# Altium schematic sheet Display.SchDoc: EPD driver and connector
size A4; Date: Not used; ApprovedBy: Not used; CheckedBy: Not used; Author: Not used; CompanyName: STMicroelectronics; DrawnBy: Not used; Engineer: Not used; Organization: Not used; Address1: Not used; Address2: Not used; Address3: Not used; Address4: Not used; DocumentNumber: Not used; Revision: 1.0.0; SheetNumber: 3; SheetTotal: 6; CurrentTime: Not used; CurrentDate: Not used; Time: Not used; DocumentFullPathAndName: Not used; DocumentName: Not used; ModifiedDate: Not used; ImagePath: Not used; ProjectName: Not used; Application_BuildNumber: Not used
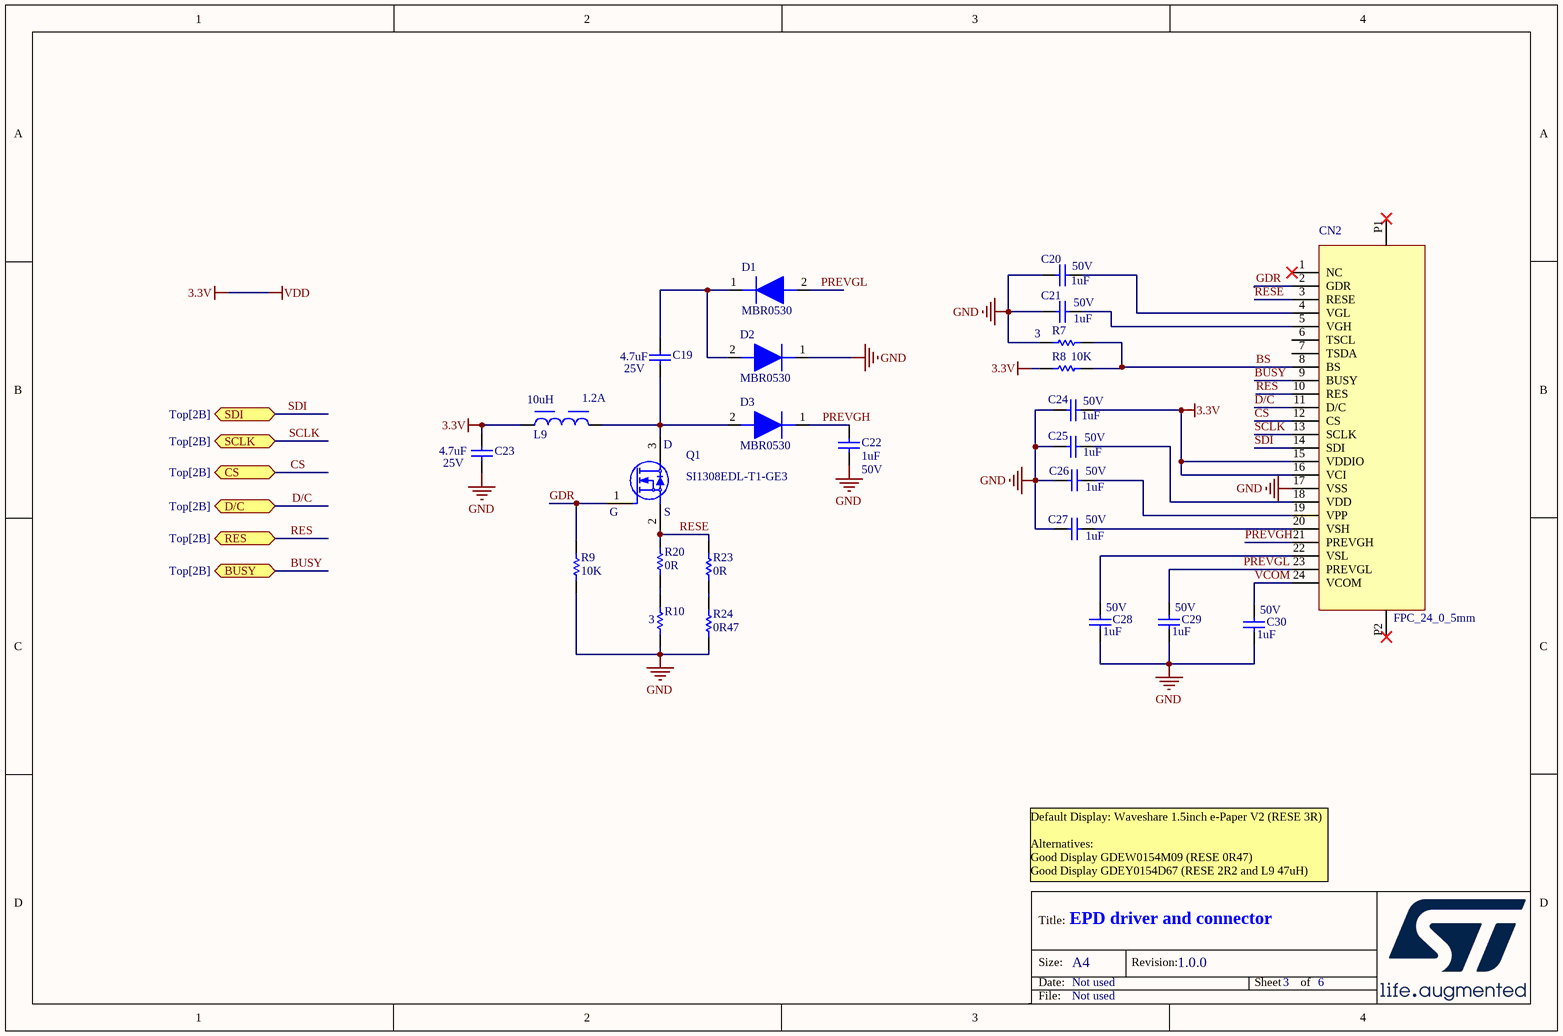
[diagram p0: Display.SchDoc]

## Parts
C19  value 4.7uF  Voltage: 25V  [C0603]  (hidden comment: Capacitor)
C20  value 1uF  Voltage Rating: 50V  [C0603_H0P8]  (hidden comment: Capacitor)
C21  value 1uF  Voltage Rating: 50V  [C0603_H0P8]  (hidden comment: Capacitor)
C22  value 1uF  Voltage Rating: 50V  [C0603_H0P8]  (hidden comment: Capacitor)
C23  value 4.7uF  Voltage: 25V  [C0603]  (hidden comment: Capacitor)
C24  value 1uF  Voltage Rating: 50V  [C0603_H0P8]  (hidden comment: Capacitor)
C25  value 1uF  Voltage Rating: 50V  [C0603_H0P8]  (hidden comment: Capacitor)
C26  value 1uF  Voltage Rating: 50V  [C0603_H0P8]  (hidden comment: Capacitor)
C27  value 1uF  Voltage Rating: 50V  [C0603_H0P8]  (hidden comment: Capacitor)
C28  value 1uF  Voltage Rating: 50V  [C0603_H0P8]  (hidden comment: Capacitor)
C29  value 1uF  Voltage Rating: 50V  [C0603_H0P8]  (hidden comment: Capacitor)
C30  value 1uF  Voltage Rating: 50V  [C0603_H0P8]  (hidden comment: Capacitor)
CN2  FPC_24_0_5mm  [CON_5034802400_MOL]
D1  MBR0530  [SOD3716X135N]
D2  MBR0530  [SOD3716X135N]
D3  MBR0530  [SOD3716X135N]
L9  Inductance: 10uH  Rated Current: 1.2A  [WE-LQS_4018]  (hidden comment: 10uH, 1.2A)
Q1  value SI1308EDL-T1-GE3  [MOS_SOT323-3L]  (hidden comment: MOSFET_N-CHANNEL)
R7  value 3  [R0402]  (hidden comment: Resistor)
R8  value 10K  [R0402]  (hidden comment: Resistor)
R9  value 10K  [R0402]  (hidden comment: Resistor)
R10  value 3  [R0402]  (hidden comment: Resistor)
R20  value 0R  [R0402]  (hidden comment: Resistor)
R23  value 0R  [R0402]  (hidden comment: Resistor)
R24  value 0R47  [R0402]  (hidden comment: Resistor)

## Ports
BUSY (bidir, see Top[2B]), CS (bidir, see Top[2B]), D/C (bidir, see Top[2B]), RES (bidir, see Top[2B]), SCLK (bidir, see Top[2B]), SDI (bidir, see Top[2B])

## Nets
3.3V: C23.2 C24.2 CN2.15(VDDIO) CN2.16(VCI) L9.1 R8.1  [also labelled VDD]
GND: C20.1 C21.1 C22.1 C23.1 C24.1 C25.1 C26.1 C27.1 C28.1 C29.1 C30.1 CN2.17(VSS) D2.1 R7.2 R9.1 R10.1 R24.2
BS: CN2.8(BS) R7.1 R8.2
BUSY: CN2.9(BUSY) ; port BUSY
CS: CN2.12(CS) ; port CS
D/C: CN2.11(D/C) ; port D/C
GDR: CN2.2(GDR) Q1.1(G) R9.2
PREVGH: C22.2 CN2.21(PREVGH) D3.1
PREVGL: C29.2 CN2.23(PREVGL) D1.2
RES: CN2.10(RES) ; port RES
RESE: CN2.3(RESE) Q1.2(S) R20.2 R23.2
SCLK: CN2.13(SCLK) ; port SCLK
SDI: CN2.14(SDI) ; port SDI
VCOM: C30.2 CN2.24(VCOM)
NetC19_1: C19.1 D3.2 L9.2 Q1.3(D)
NetC19_2: C19.2 D1.1 D2.2
NetC20_2: C20.2 CN2.4(VGL)
NetC21_2: C21.2 CN2.5(VGH)
NetC25_2: C25.2 CN2.18(VDD)
NetC26_2: C26.2 CN2.19(VPP)
NetC27_2: C27.2 CN2.20(VSH)
NetC28_2: C28.2 CN2.22(VSL)
NetR10_2: R10.2 R20.1
NetR23_1: R23.1 R24.1

Not connected (* = marked no-connect by the designer): CN2 1(NC)* 6(TSCL) 7(TSDA) P1(NC)* P2(NC)*

## Notes on the sheet
- Default Display: Waveshare 1.5inch e-Paper V2 (RESE 3R)
  Alternatives:
  Good Display GDEW0154M09 (RESE 0R47)
  Good Display GDEY0154D67 (RESE 2R2 and L9 47uH)
- Title:
- Size:
- Date:
- A4
- Revision:
- Sheet
- of
- File:

## Library data of the parts
C19 C23 = MCD-02196: CAP CER 4.7UF 25V X6S 0603; Manufacturer: Murata; Manufacturer Part Number: GRM188C81E475KE11D; ComponentLink1URL: http://tunmcdsvn.tun.st.com/Component_Documentation_Library/Trunk/Capacitor/TDK_C_Series; Supplier 1: Digi-Key; Supplier Part Number 1: 490-7199-1-ND; RoHS: Yes; Category: Ceramic Capacitors; Stock 1: 947554; Pricing 1: 1=0.27, 10=0.175, 50=0.1104, 100=0.0884, 500=0.06382, 1000=0.05645 (USD); ComponentLink2URL: https://datasheet.ciiva.com/14906/partnumbering-e-01-14906423.pdf?src-supplier=Digi-Key; ComponentLink2Description: https://datasheet.ciiva.com/14906/partnumbering-e-01-14906423.pdf?src-supplier=Digi-Key; ComponentLink3URL: https://datasheet.ciiva.com/14906/partnumbering-e-01-14906424.pdf?src-supplier=Digi-Key; ComponentLink3Description: https://datasheet.ciiva.com/14906/partnumbering-e-01-14906424.pdf?src-supplier=Digi-Key; ComponentLink4URL: https://datasheet.ciiva.com/14906/partnumbering-e-01-14906425.pdf?src-supplier=Digi-Key; ComponentLink4Description: https://datasheet.ciiva.com/14906/partnumbering-e-01-14906425.pdf?src-supplier=Digi-Key
C20-C22 C24-C30 = MCD-01703: Multilayer Ceramic Capacitor, 1 uF, 50 V, ± 10%, X5R, 0603 [1608 Metric]; Manufacturer: Murata; Manufacturer Part Number: GRT188R61H105KE13D; ComponentLink1URL: http://tunmcdsvn.tun.st.com/Component_Documentation_Library/Trunk/Capacitor/YAGEO_X5R_Series; Supplier 1: Digi-Key; Supplier Part Number 1: 490-12330-1-ND; RoHS: Yes; Category: Ceramic Capacitors; Stock 1: 422240; Pricing 1: 1=0.17, 10=0.117, 50=0.07, 100=0.0551, 500=0.04066, 1000=0.03366 (USD); Mounting Technology: Surface Mount; Case/Package: 0603; Case Code (Metric): 1608; Case Code (Imperial): 0603; Min Operating Temperature: -55°C; Max Operating Temperature: 85°C; Packaging: Cut Tape; Tolerance: 10%; Dielectric: X5R; Voltage Rating (DC): 50V; Series: GRT; Length: 0.063inch; Width: 0.031inch; Thickness: 0.035inch; Ratings: AEC-Q200; RoHS Compliant: Yes; ComponentLink2URL: http://www.farnell.com/datasheets/2165959.pdf?src-supplier=Farnell; ComponentLink2Description: http://www.farnell.com/datasheets/2165959.pdf?src-supplier=Farnell; ComponentLink3URL: http://search.murata.co.jp/Ceramy/image/img/A01X/G101/ENG/GRT188R61H105KE13-01.pdf?src-supplier=Digi-Key; ComponentLink3Description: http://search.murata.co.jp/Ceramy/image/img/A01X/G101/ENG/GRT188R61H105KE13-01.pdf?src-supplier=Digi-Key; ComponentLink4URL: http://www.farnell.com/datasheets/2165959.pdf?src-supplier=Newark; ComponentLink4Description: http://www.farnell.com/datasheets/2165959.pdf?src-supplier=Newark; ComponentLink5URL: https://datasheet.octopart.com/GRT188R61H105KE13D-Murata-datasheet-67697751.pdf?src-supplier=Newark; ComponentLink5Description: https://datasheet.octopart.com/GRT188R61H105KE13D-Murata-datasheet-67697751.pdf?src-supplier=Newark; ComponentLink6URL: https://search.murata.co.jp/Ceramy/image/img/A01X/G101/ENG/GRT188R61H105KE13-01.pdf?src-supplier=Digi-Key; ComponentLink6Description: https://search.murata.co.jp/Ceramy/image/img/A01X/G101/ENG/GRT188R61H105KE13-01.pdf?src-supplier=Digi-Key; ComponentLink7URL: https://datasheet.octopart.com/GRT188R61H105KE13D-Murata-datasheet-165579666.pdf?src-supplier=TME; ComponentLink7Description: https://datasheet.octopart.com/GRT188R61H105KE13D-Murata-datasheet-165579666.pdf?src-supplier=TME
CN2 = FPC_24_0_5mm: Conn, Ffc/fpc, R/a, 24Pos, 1Row, 0.5Mm Rohs Compliant: Yes; Manufacturer: Molex; Manufacturer Part Number: 503480-2400; Supplier 1: Digi-Key; Supplier Part Number 1: WM27000CT-ND; RoHS: No; Category: FFC / FPC; Stock 1: 23010; Pricing 1: 1=2.12, 10=1.806, 100=1.492, 1000=1.17791 (USD)
D1-D3 = MBR0530: Diode, Schottky Barrier, Vr 30V, If 0.5A, Pkg SOD-123, Vf 0.43V, Tj +125degc, Cs 5.5A; Manufacturer: ON Semiconductor / Fairchild; Manufacturer Part Number: MBR0530T1G; Supplier 1: Arrow Electronics; Supplier Part Number 1: MBR0530T1G; RoHS: Yes; Category: Schottky Diodes; Stock 1: 24000; Pricing 1: 3000=0.0566, 9000=0.0503, 24000=0.0471, 45000=0.0409 (USD); ComponentLink1URL: https://datasheet.ciiva.com/5763/85890-5763210.pdf?src-supplier=Farnell; ComponentLink1Description: https://datasheet.ciiva.com/5763/85890-5763210.pdf?src-supplier=Farnell; ComponentLink2URL: https://datasheet.ciiva.com/14168/sz600926-e-14168053.pdf?src-supplier=Distrelec; ComponentLink2Description: https://datasheet.ciiva.com/14168/sz600926-e-14168053.pdf?src-supplier=Distrelec; ComponentLink3URL: https://datasheet.ciiva.com/22659/1708258-22659024.pdf?src-supplier=Element14; ComponentLink3Description: https://datasheet.ciiva.com/22659/1708258-22659024.pdf?src-supplier=Element14; ComponentLink4URL: https://datasheet.ciiva.com/8299/mbr0530t1-d-8299686.pdf?src-supplier=Avnet; ComponentLink4Description: https://datasheet.ciiva.com/8299/mbr0530t1-d-8299686.pdf?src-supplier=Avnet; ComponentLink5URL: https://datasheet.ciiva.com/8300/mbr0530t1-d-8300038.pdf?src-supplier=Avnet; ComponentLink5Description: https://datasheet.ciiva.com/8300/mbr0530t1-d-8300038.pdf?src-supplier=Avnet; ComponentLink6URL: https://datasheet.ciiva.com/915/mbr0530t1-d-915467.pdf?src-supplier=Digi-Key; ComponentLink6Description: https://datasheet.ciiva.com/915/mbr0530t1-d-915467.pdf?src-supplier=Digi-Key; ComponentLink7URL: https://datasheet.ciiva.com/915/mbr0530t1-d-915468.pdf?src-supplier=Digi-Key; ComponentLink7Description: https://datasheet.ciiva.com/915/mbr0530t1-d-915468.pdf?src-supplier=Digi-Key; ComponentLink8URL: https://datasheet.ciiva.com/915/mbr0530t1-d-915469.pdf?src-supplier=Digi-Key; ComponentLink8Description: https://datasheet.ciiva.com/915/mbr0530t1-d-915469.pdf?src-supplier=Digi-Key; ComponentLink9URL: https://datasheet.ciiva.com/14560/70099496-14560951.pdf?src-supplier=Allied+Electronics; ComponentLink9Description: https://datasheet.ciiva.com/14560/70099496-14560951.pdf?src-supplier=Allied+Electronics; ComponentLink10URL: https://datasheet.ciiva.com/7962/85890-7962700.pdf?src-supplier=Element14; ComponentLink10Description: https://datasheet.ciiva.com/7962/85890-7962700.pdf?src-supplier=Element14; ComponentLink11URL: https://datasheet.ciiva.com/7962/85890-7962701.pdf?src-supplier=Element14; ComponentLink11Description: https://datasheet.ciiva.com/7962/85890-7962701.pdf?src-supplier=Element14; ComponentLink12URL: https://datasheet.ciiva.com/7962/85890-7962702.pdf?src-supplier=Element14; ComponentLink12Description: https://datasheet.ciiva.com/7962/85890-7962702.pdf?src-supplier=Element14
L9 = 74404042100: WE-LQS SMT Power Inductor, size 4018, 10uH, 1.2A, 0.15Ohm; Manufacturer: Wurth Elektronik; Case/Size Code: 4018; Saturation Current: 1.7A; Self Resonant Frequency: 28MHz; Manufacturer Part Number: 74404042100; Category: Power Inductors; Match Code: WE-LQS; ComponentLink1Description: Website Link; ComponentLink1URL: https://www.we-online.com/redexpert/article/74404042100?ad; ComponentLink2Description: Datasheet Link; ComponentLink2URL: https://www.we-online.com/redexpert/spec/74404042100?ad; Mount: Surface Mount; Operating Temperature Max: 125°C; Operating Temperature Min: -40°C; Packaging: Tape and Reel; Length: 4mm; Width: 4mm; Height: 1.8mm; DC Resistance: 0.15Ohm
Q1 = SI1308EDL: Transistor, MOSFET, N-CH, 30V, 1.4A, SOT-323; Internal_Part_Number: MCD-02504; Part_Preference: Recommended; Manufacturer: VISHAY; Order_Code_RS: 165-7247; Component_Country_Of_Origin: China; ShowFields: YES; ID: 4610; Status: Released; Part_Type: Transistor; Manufacturer_Part_Number: SI1308EDL-T1-GE3; Package: SOT323-3; ComponentLink1URL: http://tunmcdsvn.tun.st.com/Component_Documentation_Library/Trunk/Transistor/VISHAY_SI1308EDL-T1-GE3; Order_Code_Digikey: SI1308EDL-T1-GE3TR-ND; Order_Code_Farnell: 2283646; Manufacturer Part Number: SI1308EDL-T1-GE3
R7 R10 = MCD-02517: Res Thick Film 0402 3 Ohm 1% 1/16W ±200ppm/°C Molded SMD Paper T/R; Manufacturer: Yageo; Manufacturer Part Number: RC0402FR-073RL; ComponentLink1URL: http://tunmcdsvn.tun.st.com/Component_Documentation_Library/Trunk/Resistor/YAGEO_RL_Series; Supplier 1: Farnell; Supplier Part Number 1: 3974298; RoHS: Yes; Category: Chip SMD Resistors; Stock 1: 8190; Pricing 1: 10=0.014, 100=0.008, 500=0.007, 2500=0.005, 5000=0.004, 10000=0.002, 50000=0.0019, 100000=0.0018 (EUR); ComponentLink2URL: https://datasheet.ciiva.com/22655/443714-22655095.pdf?src-supplier=Farnell; ComponentLink2Description: https://datasheet.ciiva.com/22655/443714-22655095.pdf?src-supplier=Farnell; ComponentLink3URL: https://datasheet.ciiva.com/6069/443714-6069962.pdf?src-supplier=Farnell; ComponentLink3Description: https://datasheet.ciiva.com/6069/443714-6069962.pdf?src-supplier=Farnell; ComponentLink4URL: https://datasheet.ciiva.com/16746/pyu-rc0402-51-rohs-l-6-r-16746959.pdf?src-supplier=Future+Electronics; ComponentLink4Description: https://datasheet.ciiva.com/16746/pyu-rc0402-51-rohs-l-6-r-16746959.pdf?src-supplier=Future+Electronics
R8 R9 = MCD-02551: Resistor, 10K, 0402, +/-0.1%, 1/16W, +/-25ppm/°C; Part_Preference: Recommended; Manufacturer: YAGEO; Manufacturer_Part_Number: RT0402BRD0710KL; Order_Code_RS: 1991270; ShowFields: YES; ID: 4657; Internal_Part_Number: MCD-02551; Status: Checked; Part_Type: Resistor; Package: 0402; ComponentLink1URL: http://tunmcdsvn.tun.st.com/Component_Documentation_Library/Trunk/Resistor/YAGEO_RT_Series; Order_Code_Digikey: YAG1346TR-ND; Order_Code_Farnell: 3496450RL; Manufacturer Part Number: RT0402BRD0710KL
R20 R23 = MCD-00052: Resistor, 0R, 0402, +/-5%, 1/16W; Part_Preference: Recommended; Manufacturer: YAGEO; Manufacturer_Part_Number: RC0402JR-070RL; Order_Code_RS: 9232516RL; Component_Country_Of_Origin: China; ShowFields: YES; ID: 2540; Internal_Part_Number: MCD-00052; Status: Released; Part_Type: Resistor; Package: 0402; ComponentLink1URL: http://tunmcdsvn.tun.st.com/Component_Documentation_Library/Trunk/Resistor/YAGEO_RC_L_Series; Order_Code_Digikey: 311-0.0JRCT-ND; Order_Code_Farnell: 9232516RL; Manufacturer Part Number: RC0402JR-070RL
R24 = MCD-02517: Resistor, 0R47, 0402, +/-1%, 1/16W; Part_Preference: Recommended; Manufacturer: YAGEO; Manufacturer_Part_Number: RL0402FR-070R47L; Component_Country_Of_Origin: China; ShowFields: YES; ID: 4623; Internal_Part_Number: MCD-02517; Status: Checked; Part_Type: Resistor; Package: 0402; ComponentLink1URL: http://tunmcdsvn.tun.st.com/Component_Documentation_Library/Trunk/Resistor/YAGEO_RL_Series; Order_Code_Digikey: 311-.47PTR-ND; Order_Code_Farnell: N/A; Order_Code_RS: N/A; Manufacturer Part Number: RL0402FR-070R47L